# EAGLE design eCog116_Pi_RGB_Matrix (EAGLE 6.6.0)
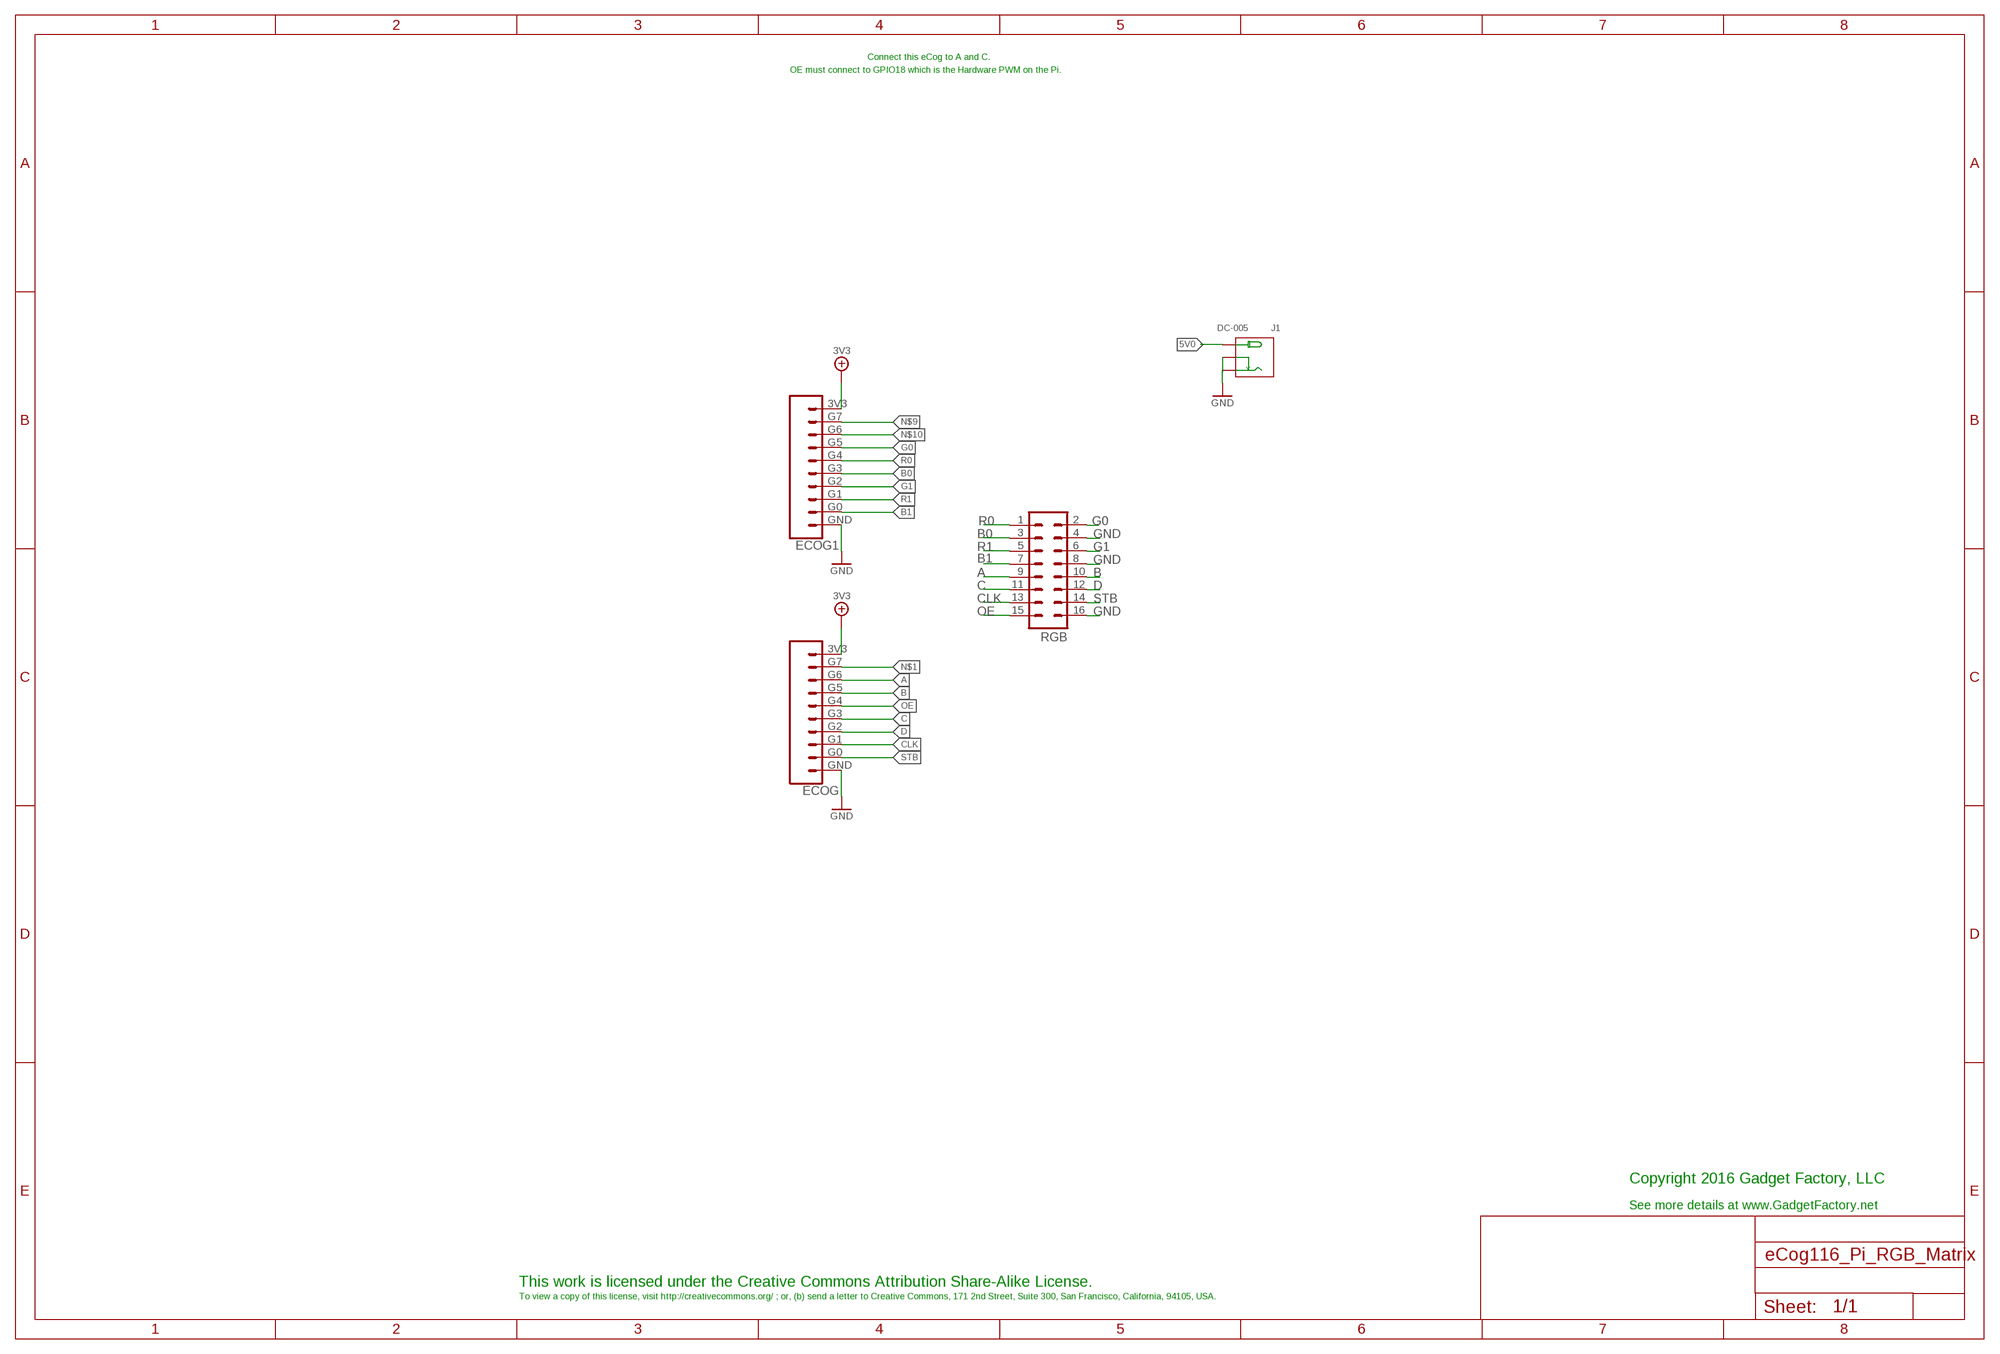
[diagram p0: schematic, sheet 1]

## Parts
ECOG  ECOG_GENERAL_ROWTHROUGHOLE  [ECOG_GENERAL_TH]
ECOG1  ECOG_GENERAL_ROWTHROUGHOLE  [ECOG_GENERAL_TH]
J1  DC-005  CONN-POWER-JACK-2.1MM(DC-005)  [DCJ3P-14.2X11.0X9.0MM]
RGB  ML16  [ML16]

## Nets
3V3: ECOG1.3V3 ECOG.3V3
5V0: J1.+
A: ECOG.G6 RGB.9
B: ECOG.G5 RGB.10
B0: ECOG1.G3 RGB.3
B1: ECOG1.G0 RGB.7
C: ECOG.G3 RGB.11
CLK: ECOG.G1 RGB.13
D: ECOG.G2 RGB.12
G0: ECOG1.G5 RGB.2
G1: ECOG1.G2 RGB.6
GND: ECOG1.GND ECOG.GND J1.-1(-) J1.-2(CDN) RGB.4 RGB.8 RGB.16
N$1: ECOG.G7
N$9: ECOG1.G7
N$10: ECOG1.G6
OE: ECOG.G4 RGB.15
R0: ECOG1.G4 RGB.1
R1: ECOG1.G1 RGB.5
STB: ECOG.G0 RGB.14

## Notes on the sheet
- Connect this eCog to A and C.
- OE must connect to GPIO18 which is the Hardware PWM on the Pi.
- Copyright 2016 Gadget Factory, LLC
- See more details at www.GadgetFactory.net
- This work is licensed under the Creative Commons Attribution Share-Alike License.
- To view a copy of this license, visit http://creativecommons.org/ ; or, (b) send a letter to Creative Commons, 171 2nd Street, Suite 300, San Francisco, California, 94105, USA.

## Library data of the parts
ECOG ECOG1 = eCogs:ECOG_GENERAL_ROW
J1 = Seeed-OPL-Connector:CONN-POWER-JACK-2.1MM(DC-005): 320120003; MPN: DC-005
RGB = con-ml:ML16: HARTING; OC_FARNELL: unknown; OC_NEWARK: unknown; PARTNO: PRPC004DAAN-RC

## Board
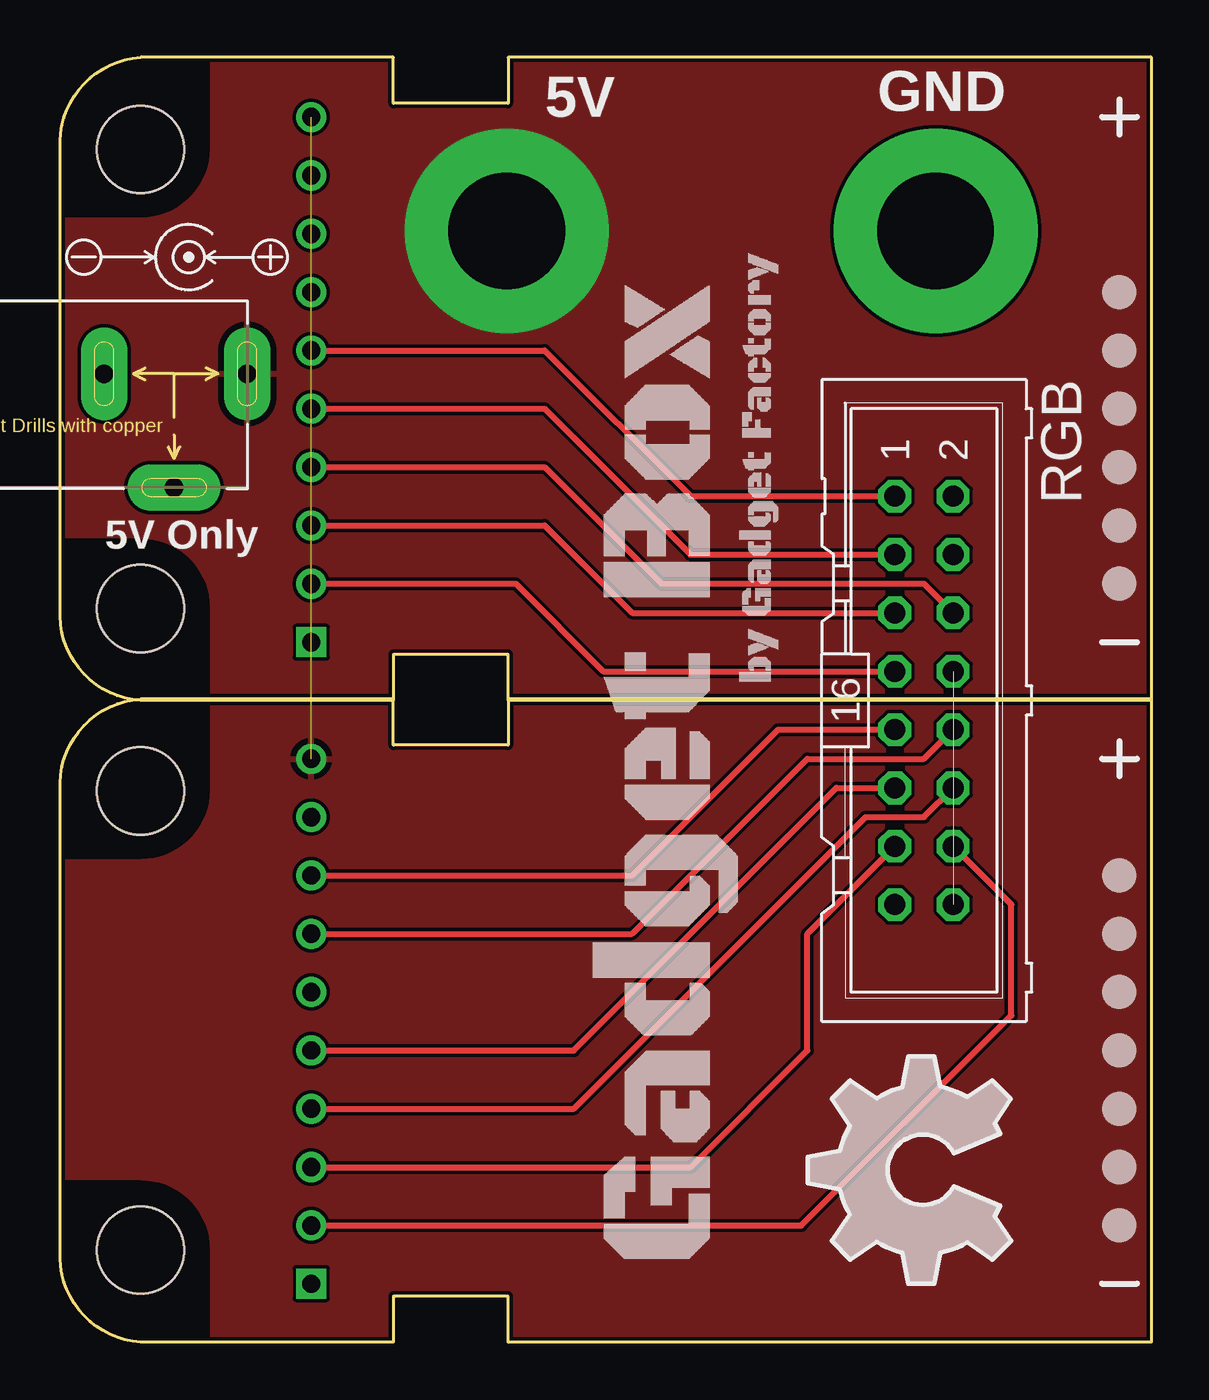
[diagram p1: board, top side]
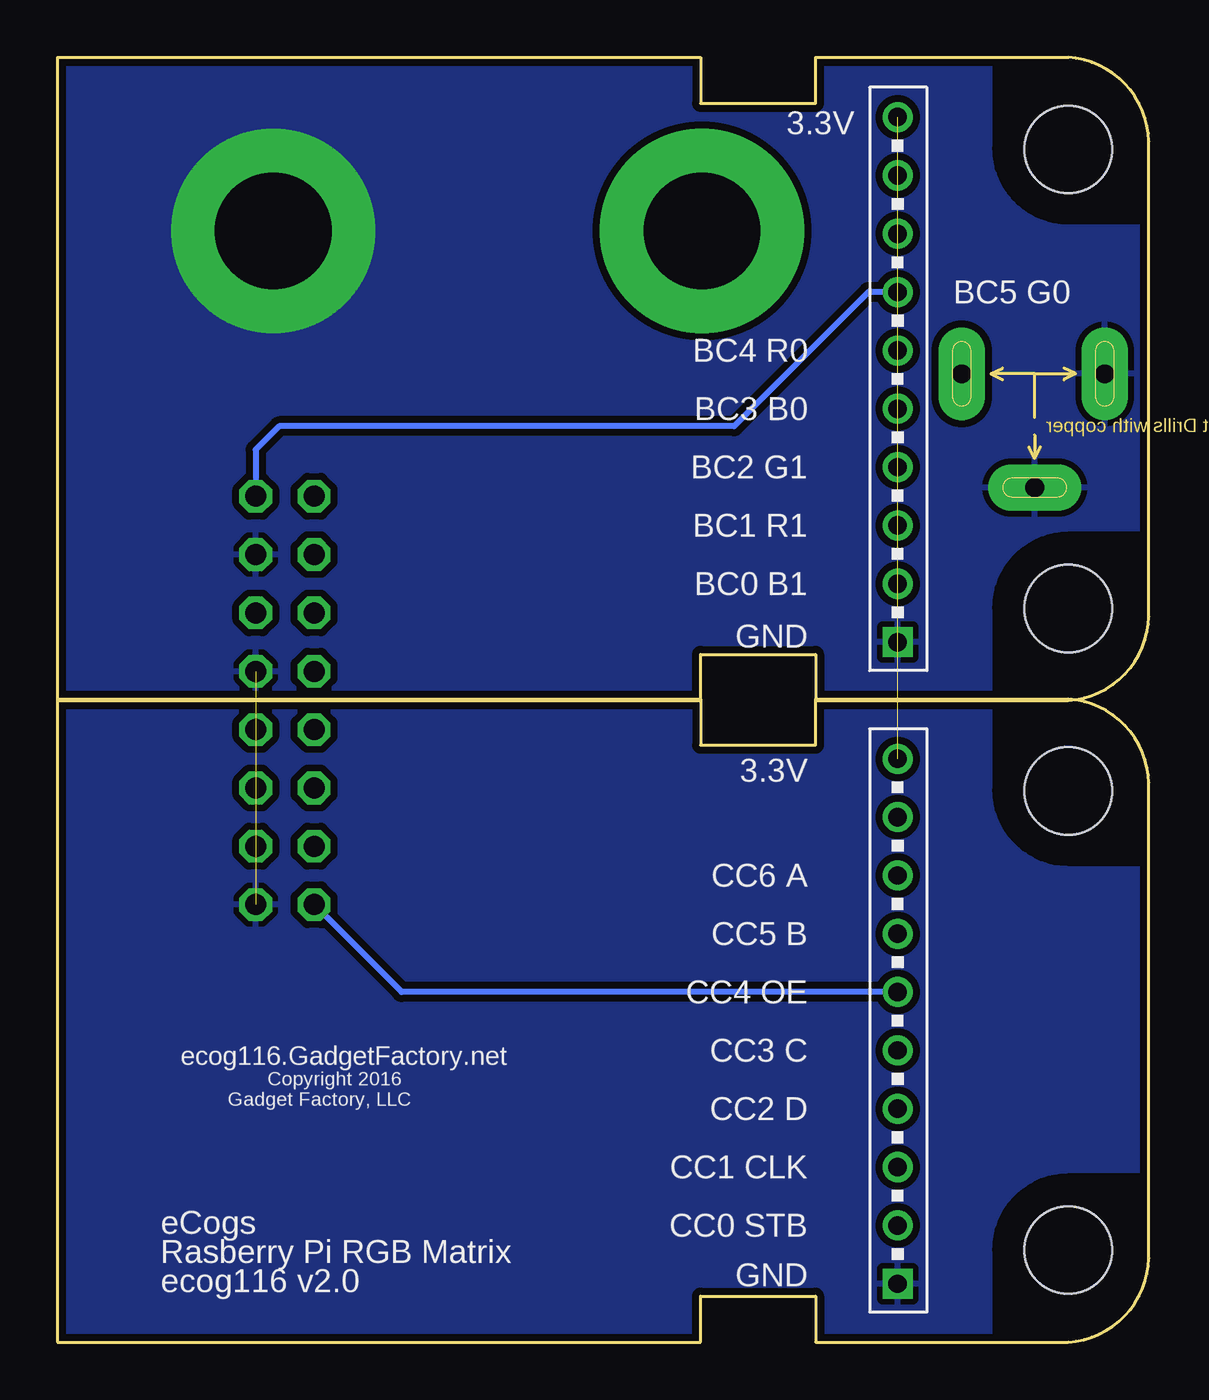
[diagram p2: board, bottom side, seen from below]

Size 47.51 x 55.94 mm. Coordinates in mm from the lower left corner, seen from the top.
Copper layers (1*16): Top 0.035mm / dielectric 1.5mm / Bottom 0.035mm
Design rules "hackvana *": minimum track width 6mil, minimum drill 0.3mm, track to track 6mil, track to pad 6mil, pad to pad 6mil, via to via 6mil, smd to smd 0mil, copper to edge 6mil, drill to drill 6mil, minimum pad ring 10mil, minimum via ring 6mil, stop-mask expansion 2mil, vias tented up to drill 100mil, thermal gap 10mil

### Footprints (pad centres in the part's own frame; a part is rotated, then mirrored left to right if it is on the bottom)
ECOG_GENERAL_TH = drill 0.8: 3V3 11.43,25.4; G0 11.43,5.08; G1 11.43,7.62; G2 11.43,10.16; G3 11.43,12.7; G4 11.43,15.24; G5 11.43,17.78; G6 11.43,20.32; G7 11.43,22.86 | drill 0.8 square: GND 11.43,2.54 | hole 3.8: 4,24; 4,4
DCJ3P-14.2X11.0X9.0MM = drill 0.813 pad 2.032 long: + 3.175,0; -1 -3.048,0; -2 0,-4.953
ML16 = drill 0.914 octagon: 1 -8.89,-1.27; 2 -8.89,1.27; 3 -6.35,-1.27; 4 -6.35,1.27; 5 -3.81,-1.27; 6 -3.81,1.27; 7 -1.27,-1.27; 8 -1.27,1.27; 9 1.27,-1.27; 10 1.27,1.27; 11 3.81,-1.27; 12 3.81,1.27; 13 6.35,-1.27; 14 6.35,1.27; 15 8.89,-1.27; 16 8.89,1.27

### Placement (x,y rotation side)
ECOG  -0.49,0 0 top
ECOG1  -0.49,27.94 0 top
J1  4.97,42.16 0 top
RGB  37.61,27.94 270 top
U$1  [GADGETBOX_TEXT]  26.56,24.89 90 top
U$2  [LEGEND_DIO]  46.12,5.08 0 top
U$3  [LEGEND_DIO]  46.12,20.32 0 top
U$4  [LEGEND_DIO]  46.12,17.78 0 top
U$5  [LEGEND_DIO]  46.12,7.62 0 top
U$6  [LEGEND_DIO]  46.12,10.16 0 top
U$7  [LEGEND_DIO]  46.12,12.7 0 top
U$8  [LEGEND_DIO]  46.12,15.24 0 top
U$9  [LEGEND_DIO]  46.12,33.02 0 top
U$10  [OSHW_FILLX350_NOTEXT]  41.42,2.54 90 top
U$11  [LEGEND_DIO]  46.12,35.56 0 top
U$12  [LEGEND_DIO]  46.12,38.1 0 top
U$13  [LEGEND_DIO]  46.12,40.64 0 top
U$14  [LEGEND_DIO]  46.12,43.18 0 top
U$15  [LEGEND_DIO]  46.12,45.72 0 top

### Tracks (layer width: path | path; a pad name or v marks a point on that pad's centre or on a via)
3V3  (1 unrouted)
  pour Top: -1.51,27.81 -1.76,27.81 -1.76,-1.27 49.04,-1.27 49.04,27.94 -1.76,27.94
5V0  (via drill 5.08 pad 8.89)
  other vias: 19.45,48.39
  pour Top: -1.49,56.94 48.51,56.94 48.51,28.21 -1.49,28.21
A
  Top 0.254: ECOG.G6 24.91,20.32 31.26,26.67 RGB.9
B
  Top 0.254: ECOG.G5 24.91,17.78 32.53,25.4 37.61,25.4 RGB.10
B0
  Top 0.254: ECOG1.G3 21.1,40.64 27.45,34.29 RGB.3
B1
  Top 0.254: ECOG1.G0 19.83,33.02 23.64,29.21 RGB.7
C
  Top 0.254: ECOG.G3 22.37,12.7 33.8,24.13 RGB.11
CLK
  Top 0.254: ECOG.G1 27.45,7.62 32.53,12.7 32.53,17.78 RGB.13
D
  Top 0.254: ECOG.G2 22.37,10.16 35.07,22.86 37.61,22.86 RGB.12
G0
  Bottom 0.254: ECOG1.G5 12.21,45.72 18.05,39.88 37.86,39.88 38.88,38.86 RGB.2
G1
  Top 0.254: ECOG1.G2 21.1,38.1 26.18,33.02 37.61,33.02 RGB.6
GND  (via drill 5.08 pad 8.89)  (1 unrouted)
  other vias: 38.12,48.39
  pour Bottom (isolate 0.305): -2.49,57.94 49.51,57.94 49.51,-2 -2.49,-2
OE
  Bottom 0.254: ECOG.G4 32.53,15.24 RGB.15
R0
  Top 0.254: ECOG1.G4 21.1,43.18 27.45,36.83 RGB.1
R1
  Top 0.254: ECOG1.G1 21.1,35.56 24.91,31.75 RGB.5
STB
  Top 0.254: ECOG.G0 32.27,5.08 41.42,14.22 41.42,19.05 RGB.14

### Text on the board
tPlace: GND | 5V | 5V Only
bPlace: 3.3V | BC5 G0 | BC4 R0 | BC3 B0 | BC2 G1 | BC1 R1 | BC0 B1 | GND | 3.3V | CC6 A | CC5 B | CC4 OE | CC3 C | ecog116.GadgetFactory.net | CC2 D | Copyright 2016 | Gadget Factory, LLC | CC1 CLK | CC0 STB | eCogs | GND | Rasberry Pi RGB Matrix | ecog116 v2.0